# EAGLE schematic TactTongue (EAGLE 9.7.0)
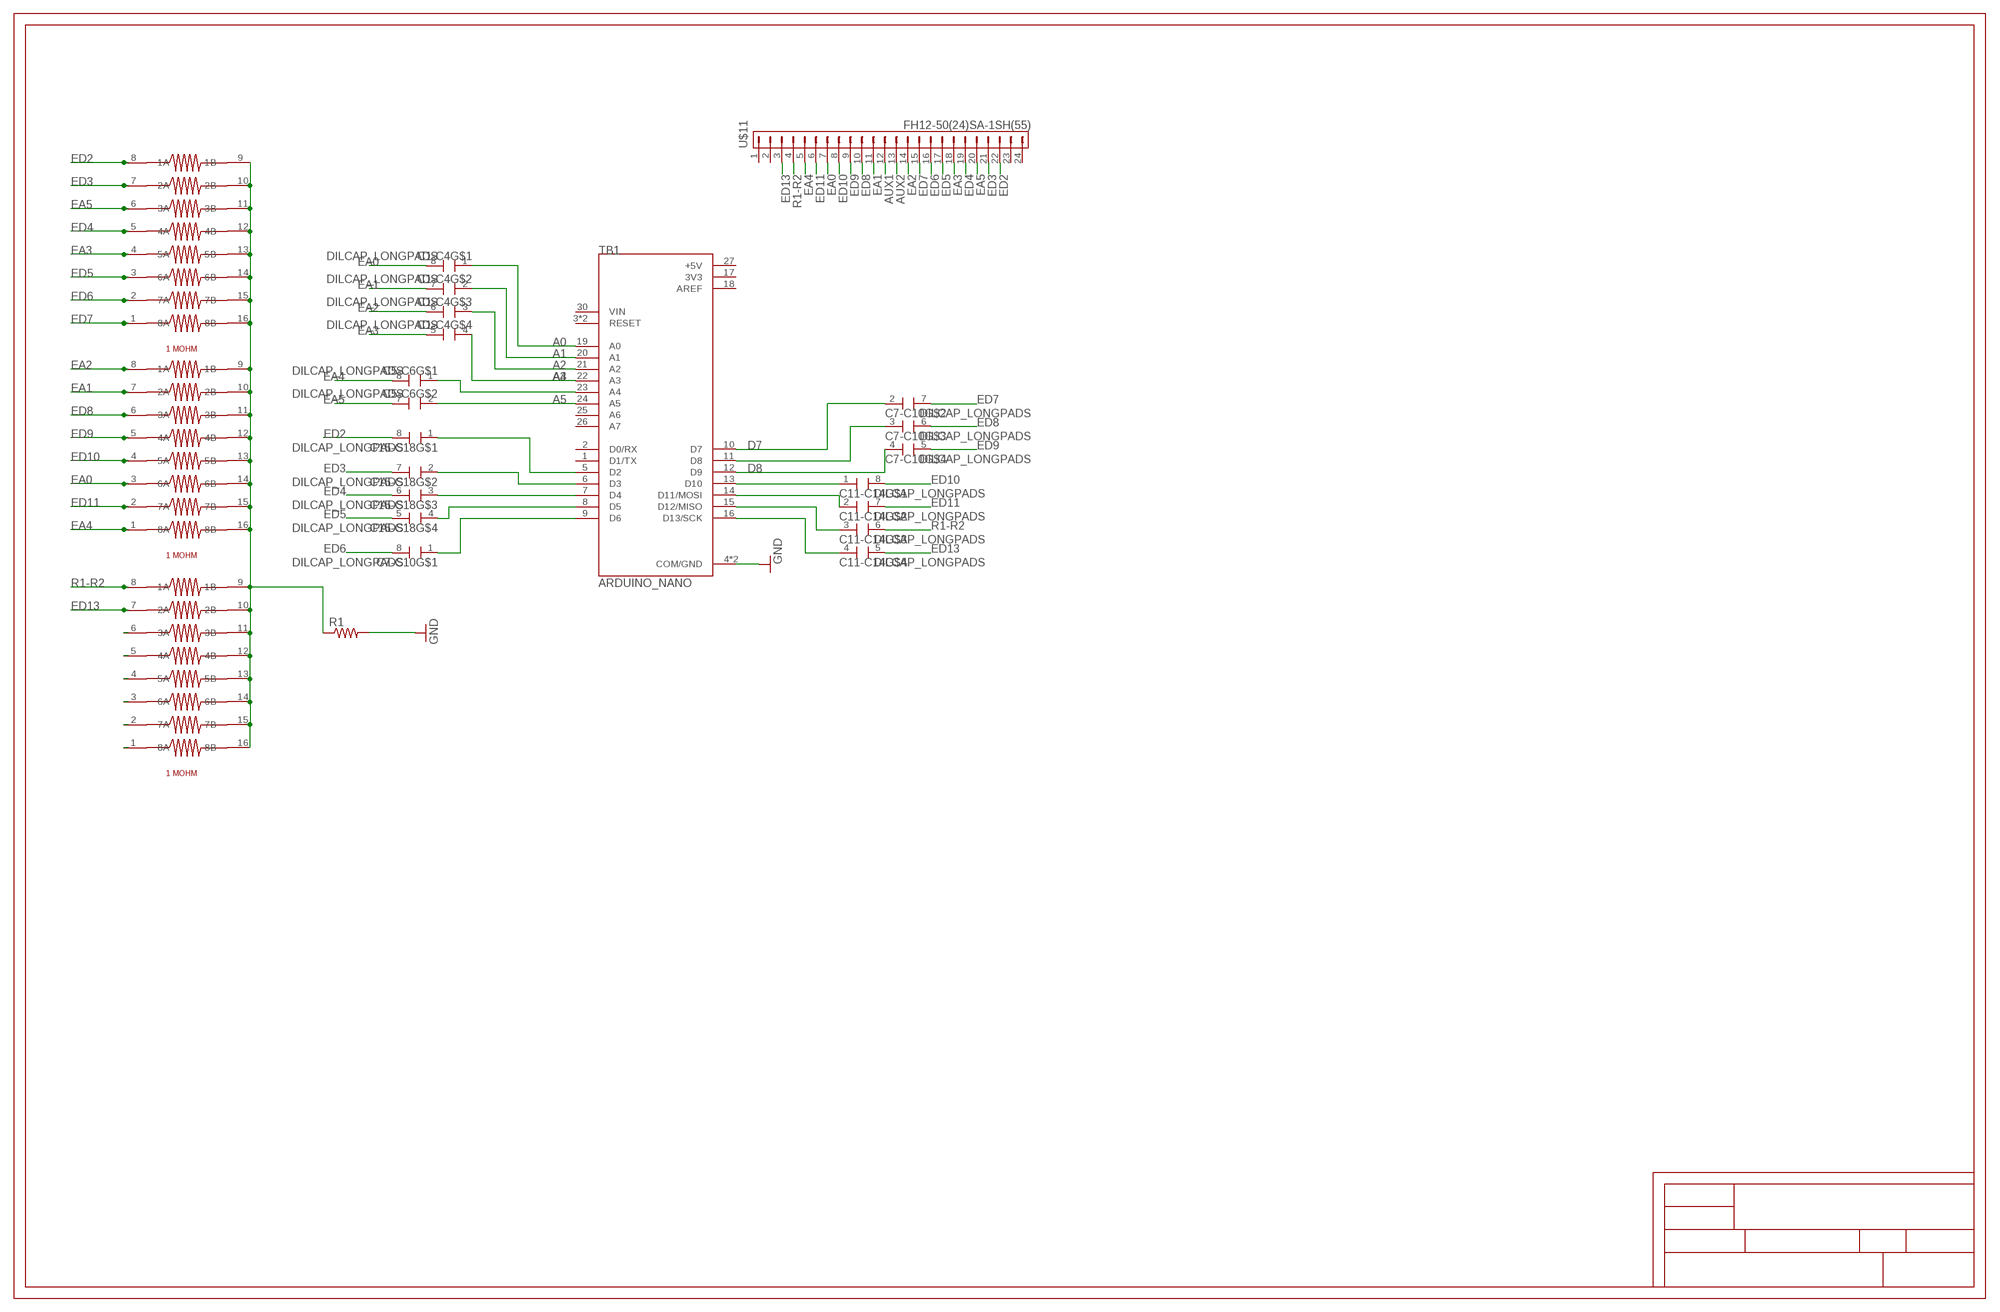
[diagram p0: schematic, sheet 1]

## Parts
C1-C4  DILCAP_LONGPADS  [RESISTOR-DIL_4X0402ARV341_LONGPADS]
C5-C6  DILCAP_LONGPADS  [RESISTOR-DIL_4X0402ARV341_LONGPADS]
C7-C10  DILCAP_LONGPADS  [RESISTOR-DIL_4X0402ARV341_LONGPADS]
C11-C14  DILCAP_LONGPADS  [RESISTOR-DIL_4X0402ARV341_LONGPADS]
C15-C18  DILCAP_LONGPADS  [RESISTOR-DIL_4X0402ARV341_LONGPADS]
R1  RESISTOR0402  [0402]
TB1  ARDUINO_NANO  [SHIELD_ARDUINO_NANO]
U$1  1MOHM8  [JJ_CUSTOM_PARTS_1MOHMARRAY]
U$2  1MOHM8  [JJ_CUSTOM_PARTS_1MOHMARRAY]
U$3  1MOHM8  [JJ_CUSTOM_PARTS_1MOHMARRAY]
U$11  FH12-50(24)SA-1SH(55)  [FH12-16S-1SH]

## Nets
A0: C1-C4.1 TB1.19(A0)
A1: C1-C4.2 TB1.20(A1)
A2: C1-C4.3 TB1.21(A2)
A3: C1-C4.4 TB1.22(A3)
A4: C5-C6.1 TB1.23(A4)
A5: C5-C6.2 TB1.24(A5)
AUX1: U$11.12
AUX2: U$11.13
D7: C7-C10.2 TB1.10(D7)
D8: C7-C10.3 TB1.11(D8)
EA0: C1-C4.8 U$2.3(6A) U$11.7
EA1: C1-C4.7 U$2.7(2A) U$11.11
EA2: C1-C4.6 U$2.8(1A) U$11.14
EA3: C1-C4.5 U$1.4(5A) U$11.18
EA4: C5-C6.8 U$2.1(8A) U$11.5
EA5: C5-C6.7 U$1.6(3A) U$11.20
ED2: C15-C18.8 U$1.8(1A) U$11.22
ED3: C15-C18.7 U$1.7(2A) U$11.21
ED4: C15-C18.6 U$1.5(4A) U$11.19
ED5: C15-C18.5 U$1.3(6A) U$11.17
ED6: C7-C10.8 U$1.2(7A) U$11.16
ED7: C7-C10.7 U$1.1(8A) U$11.15
ED8: C7-C10.6 U$2.6(3A) U$11.10
ED9: C7-C10.5 U$2.5(4A) U$11.9
ED10: C11-C14.8 U$2.4(5A) U$11.8
ED11: C11-C14.7 U$2.2(7A) U$11.6
ED13: C11-C14.5 U$3.7(2A) U$11.3
GND: R1.2 TB1.4(COM/GND) TB1.29(COM/GND)
MOHMBUSS: R1.1 U$1.9(1B) U$1.10(2B) U$1.11(3B) U$1.12(4B) U$1.13(5B) U$1.14(6B) U$1.15(7B) U$1.16(8B) U$2.9(1B) U$2.10(2B) U$2.11(3B) U$2.12(4B) U$2.13(5B) U$2.14(6B) U$2.15(7B) U$2.16(8B) U$3.9(1B) U$3.10(2B) U$3.11(3B) U$3.12(4B) U$3.13(5B) U$3.14(6B) U$3.15(7B) U$3.16(8B)
N$2: C7-C10.4 TB1.12(D9)
N$3: C15-C18.1 TB1.5(D2)
N$4: C11-C14.1 TB1.13(D10)
N$5: C11-C14.2 TB1.14(D11/MOSI)
N$6: C11-C14.3 TB1.15(D12/MISO)
N$7: C11-C14.4 TB1.16(D13/SCK)
N$8: C15-C18.2 TB1.6(D3)
N$9: C15-C18.3 TB1.7(D4)
N$10: C15-C18.4 TB1.8(D5)
N$11: C7-C10.1 TB1.9(D6)
N$76: U$3.6(3A)
N$77: U$3.5(4A)
N$78: U$3.4(5A)
N$79: U$3.3(6A)
N$80: U$3.2(7A)
N$81: U$3.1(8A)
R1-R2: C11-C14.6 U$3.8(1A) U$11.4
Unconnected: C5-C6.3 C5-C6.4 C5-C6.5 C5-C6.6 TB1.1(D1/TX) TB1.2(D0/RX) TB1.3(RESET) TB1.25(A6) TB1.26(A7) TB1.28(RESET) TB1.30(VIN) U$11.1 U$11.2 U$11.23 U$11.24

## Power pins joined to a net without a drawn wire
3V3: TB1.17(3V3)
+5V: TB1.27(+5V)
AREF: TB1.18(AREF)

## Library data of the parts
C1-C4 C5-C6 C7-C10 C11-C14 C15-C18 = Terra_4dot0_12_DIP_JJM_EB2_9-10-2018_rigid_a:DILCAP_LONGPADS
R1 = SparkFun-Resistors:RESISTOR: Generic Resistor Package
TB1 = ARDUINO_NANO:ARDUINO_NANO: Arduino Nano, Through Hole; MANUFACTURER: ARDUINO; STANDARD: Manufacturer Recommendations
U$1-U$3 = Terra_4dot0_12_DIP_JJM_EB2_9-10-2018_rigid_a:1MOHM8
U$11 = con-hirose_modified:FH12-50(24)SA-1SH(55)